# Altium schematic sheet key.SchDoc
size B; DocumentNumber: 3; SheetNumber: 3; SheetTotal: 3
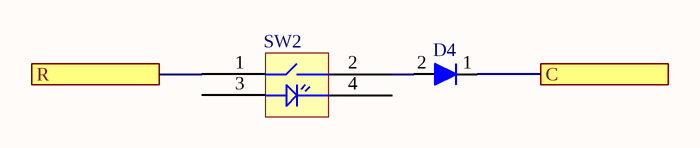
[diagram p0: key.SchDoc]

## Parts
D4  DIODE GEN PURP 100V 300MA SOD123  [1N4148W-7-F_N]  (value not drawn)
SW2  MX1A-E1NW  [CHRY_MXXX-XXXW_No_LED_MA]  (value not drawn)

## Ports
C, R

## Nets
C: D4.1(K) ; port C
R: SW2.1 ; port R
NetD4_2: D4.2(A) SW2.2

Not connected (* = marked no-connect by the designer): SW2 3 4

## Library data of the parts
D4 = 1N4148W-7-F: Manufacturer: Diodes Incorporated; SafariPartNumber: 15 15821RC; Diode Type: Standard; Current - Average Rectified (Io): 300mA (DC); Voltage - Forward (Vf) (Max) @ If: 1.25V @ 150mA; Speed: Small Signal =< 200mA (Io), Any Speed; Reverse Recovery Time (trr): 4ns; Current - Reverse Leakage @ Vr: 1µA @ 75V; Capacitance @ Vr, F: 2pF @ 0V, 1MHz; Supplier 1: Digi-Key; Supplier Part Number 1: 1N4148W-FDICT-ND; RoHS: RoHS Compliant; Category: Discrete Semiconductor Products; Stock 1: 649808; Pricing 1: 1=0.16, 10=0.149, 100=0.081, 500=0.04986, 1000=0.03399 (USD); Packaging: Cut Tape (CT); Part Status: Active; Voltage - DC Reverse (Vr) (Max): 100V; Mounting Type: Surface Mount; Package / Case: SOD-123; Supplier Device Package: SOD-123; Operating Temperature - Junction: -65°C ~ 150°C; ComponentLink1URL: http://www.diodes.com/_files/datasheets/ds30086.pdf; ComponentLink1Description: http://www.diodes.com/_files/datasheets/ds30086.pdf; Manufacturer Part Number: 1N4148W-7-F; DesignID: 1N4148W-7-F
SW2 = MX1A-E1NW: SWITCH PUSH SPST-NO 0.01A 12V; Manufacturer 1: Cherry; Mechanical Life: 20000000Cycles; Throw Configuration: SPST; Current Rating: 10mA; Contact Resistance: 200mR; Operating Force: 0.5N; Switch Function: Off-Mom; Row Spacing: 2.54mm; Actuator Length: 3.6mm; Supplier 1: Digi-Key; Stock 1: 7477; Pricing 1: 1=0.90000, 10=0.84000, 25=0.80000, 50=0.76000, 100=0.74000, 250=0.72000, 500=0.68000, 1000=0.64000, 5000=0.54000 (USD); RoHS: Yes; Mount: Through Hole; Contact Plating: Gold; Contact Material: Gold,Silver; Number of Terminals: 2; Housing Material: Thermoplastic; Min Operating Temperature: -10°C; Max Operating Temperature: 70°C; Voltage Rating (AC): 12V; Voltage Rating (DC): 12V; Packaging: Bulk; Max Voltage Rating (AC): 12V; Max Voltage Rating (DC): 12V; Max Current Rating: 10mA; Package Quantity: 1000; Termination: PC Pin; Electrical Life: 20000000Cycles; Orientation: Straight; Contact Current Rating: 10mA; Length: 15.6mm; Terminal Pitch: 6.35mm; Width: 15.6mm; Lead Free: Lead Free; Flammability Rating: UL94 HB; ComponentLink1URL: https://datasheet.ciiva.com/2869/mx20series-2869568.pdf?src-supplier=Digi-Key; ComponentLink1Description: https://datasheet.ciiva.com/2869/mx20series-2869568.pdf?src-supplier=Digi-Key; ComponentLink2URL: https://datasheet.ciiva.com/5259/mx-cat-216303-5259204.pdf?src-supplier=Mouser; ComponentLink2Description: https://datasheet.ciiva.com/5259/mx-cat-216303-5259204.pdf?src-supplier=Mouser; Supplier Part Number 1: CH197-ND; Manufacturer Part Number 1: MX1A-E1NW